# EAGLE schematic PSU_main (EAGLE 7.4.0)

## Sheet 1 of 2
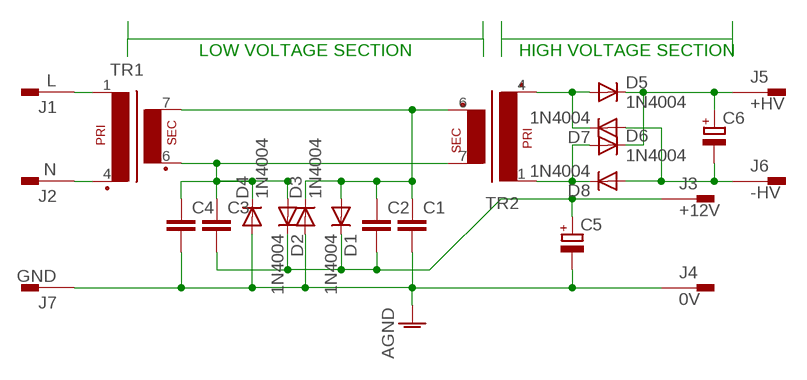
[diagram p0: schematic, sheet 1]

### Parts
C1  C5/3  [C5B3]
C2  C5/3  [C5B3]
C3  C5/3  [C5B3]
C4  C5/3  [C5B3]
C5  CPOL-EUE10-20  [EB20D]
C6  CPOL-EUE10-20  [EB20D]
D1  1N4004  [DO41-10]
D2  1N4004  [DO41-10]
D3  1N4004  [DO41-10]
D4  1N4004  [DO41-10]
D5  1N4004  [DO41-10]
D6  1N4004  [DO41-10]
D7  1N4004  [DO41-10]
D8  1N4004  [DO41-10]
J1  L  PIN1-2  [62221]
J2  N  PIN1-2  [62221]
J3  +12V  PIN1-2  [62221]
J4  0V  PIN1-2  [62221]
J5  +HV  PIN1-2  [62221]
J6  -HV  PIN1-2  [62221]
J7  GND  PIN1-2  [62221]
TR1  EE20-1  [EE20-1]
TR2  EE20-1  [EE20-1]

### Nets
+12V: C2.2 C3.2 C5.+ D1.C D2.C J3.1 ; also sheet 2
AGND: C1.2 C4.2 C5.- D3.A D4.A J4.1 J7.1 ; also sheet 2
N$1: C1.1 C2.1 D1.A D3.C TR1.7(S4) TR2.6(S3)
N$2: C3.1 C4.1 D2.A D4.C TR1.6(S3) TR2.7(S4)
N$5: D5.A D7.C TR2.4(P2)
N$6: D6.A D8.C TR2.1
N$7: C6.+ D5.C D6.C J5.1
N$8: C6.- D7.A D8.A J6.1
N$12: J1.1 TR1.1
N$13: J2.1 TR1.4(P2)

### Notes on the sheet
- LOW VOLTAGE SECTION | HIGH VOLTAGE SECTION

## Sheet 2 of 2
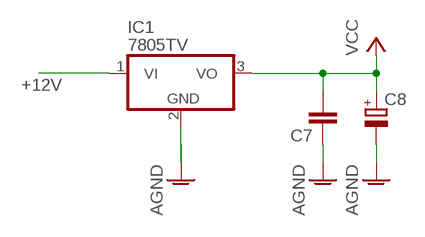
[diagram p1: schematic, sheet 2]

### Parts
C7  C-EU050-025X075  [C050-025X075]
C8  CPOL-EUE5-10.5  [E5-10,5]
IC1  7805TV  [TO220V]

### Nets
+12V: IC1.1(VI) ; also sheet 1
AGND: C7.1 C8.- IC1.2(GND) ; also sheet 1
VCC: C7.2 C8.+ IC1.3(VO)

## Library data of the parts
C1-C4 = capacitor-wima:C: CAPACITOR naming: grid - package width
C5 C6 C8 = rcl:CPOL-EU: POLARIZED CAPACITOR, European symbol
C7 = rcl:C-EU: CAPACITOR, European symbol
D1-D8 = adafruit:1N4004: DIODE General purpose 1N400x type rectifier (With bigger pads) http://www.ladyada.net/library/pcb/eaglelibrary.html
IC1 = linear:78*: Positive VOLTAGE REGULATOR Source: http://cache.national.com/ds/LM/LM78L05.pdf http://www.fairchildsemi.com/ds/LM/LM7805.pdf
J1-J7 = con-faston:PIN1-2: CONN TAB FASTON BRASS .187 PCB TAB, FSSTON, DUAL STAKE, .187 SERIES Digi-Key Part Number: A24734CT-ND Source: Tyco Electronics Corporation .. ENG_CD_62221_R.pdf http://search.digikey.com/scripts/DkSearch/dksus.dll?Detail&name=A24734CT-ND; MF: TYCO ELECTRONICS; MPN: 62221-1; OC_FARNELL: unknown; OC_NEWARK: 16H2318
TR1 TR2 = trafo:EE20-1: TRANSFORMER 1 primary winding, 1 secondary winding ERA